# Altium schematic sheet TOP.SchDoc
size Tabloid
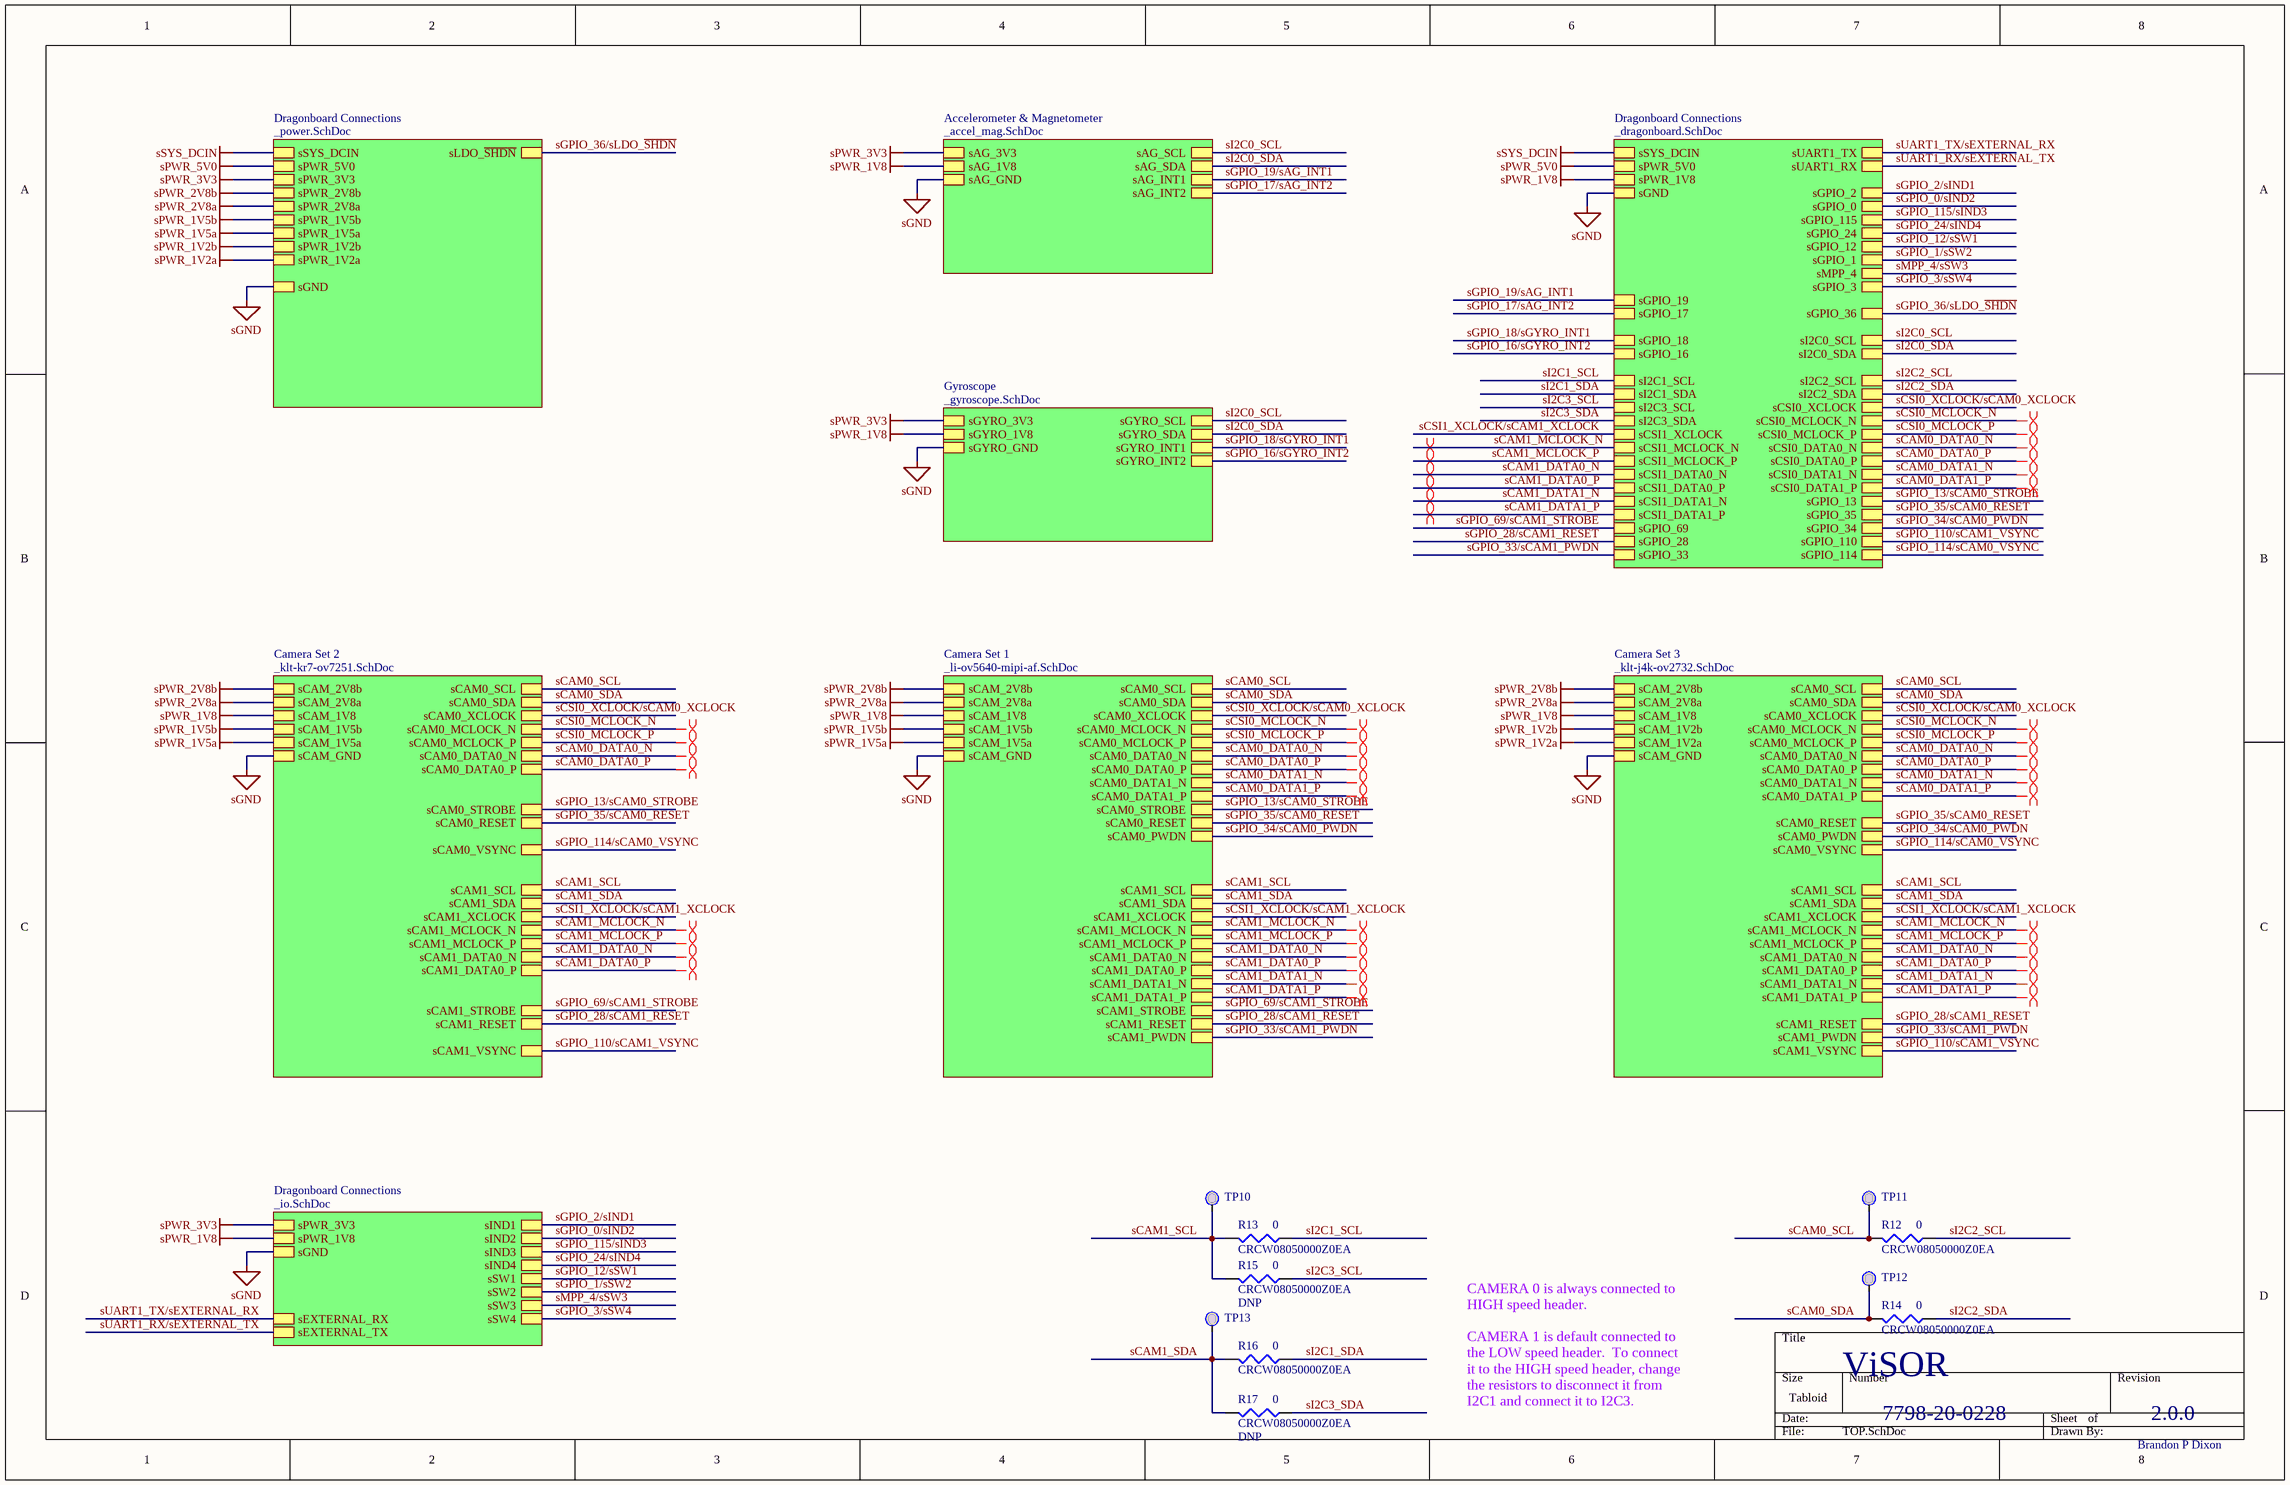
[diagram p0: TOP.SchDoc]

## Parts
R12  CRCW08050000Z0EA  value 0  [6-0805_M]
R13  CRCW08050000Z0EA  value 0  [6-0805_M]
R14  CRCW08050000Z0EA  value 0  [6-0805_M]
R15  CRCW08050000Z0EA  value 0  [6-0805_M]
R16  CRCW08050000Z0EA  value 0  [6-0805_M]
R17  CRCW08050000Z0EA  value 0  [6-0805_M]
TP10  TP  [TP_TH]  (value not drawn)
TP11  TP  [TP_TH]  (value not drawn)
TP12  TP  [TP_TH]  (value not drawn)
TP13  TP  [TP_TH]  (value not drawn)

## Sub-sheets
Accelerometer & Magnetometer = _accel_mag.SchDoc: sAG_GND, sAG_3V3, sAG_1V8, sAG_SCL, sAG_SDA, sAG_INT1, sAG_INT2
Camera Set 1 = _li-ov5640-mipi-af.SchDoc: sCAM_GND, sCAM_1V8, sCAM_1V5a, sCAM_1V5b, sCAM_2V8a, sCAM_2V8b, sCAM0_SCL, sCAM0_SDA, sCAM0_DATA0_N, sCAM0_DATA0_P, sCAM0_DATA1_N, sCAM0_DATA1_P, sCAM0_MCLOCK_N, sCAM0_MCLOCK_P, sCAM0_XCLOCK, sCAM0_STROBE, sCAM0_RESET, sCAM0_PWDN, sCAM1_SCL, sCAM1_SDA, sCAM1_DATA0_N, sCAM1_DATA0_P, sCAM1_DATA1_N, sCAM1_DATA1_P, sCAM1_MCLOCK_N, sCAM1_MCLOCK_P, sCAM1_XCLOCK, sCAM1_STROBE, sCAM1_RESET, sCAM1_PWDN
Camera Set 2 = _klt-kr7-ov7251.SchDoc: sCAM_GND, sCAM_1V8, sCAM_1V5a, sCAM_1V5b, sCAM_2V8a, sCAM_2V8b, sCAM0_SCL, sCAM0_SDA, sCAM0_DATA0_N, sCAM0_DATA0_P, sCAM0_MCLOCK_N, sCAM0_MCLOCK_P, sCAM0_XCLOCK, sCAM1_MCLOCK_N, sCAM1_MCLOCK_P, sCAM0_STROBE, sCAM0_RESET, sCAM0_VSYNC, sCAM1_STROBE, sCAM1_RESET, sCAM1_VSYNC, sCAM1_DATA0_N, sCAM1_DATA0_P, sCAM1_SCL, sCAM1_SDA, sCAM1_XCLOCK
Camera Set 3 = _klt-j4k-ov2732.SchDoc: sCAM_GND, sCAM_1V8, sCAM_1V2a, sCAM_1V2b, sCAM_2V8a, sCAM_2V8b, sCAM0_SCL, sCAM0_SDA, sCAM0_DATA0_N, sCAM0_DATA0_P, sCAM0_MCLOCK_N, sCAM0_MCLOCK_P, sCAM0_XCLOCK, sCAM0_RESET, sCAM0_VSYNC, sCAM1_VSYNC, sCAM0_DATA1_N, sCAM0_DATA1_P, sCAM1_SCL, sCAM1_SDA, sCAM1_DATA0_N, sCAM1_DATA0_P, sCAM1_MCLOCK_N, sCAM1_MCLOCK_P, sCAM1_XCLOCK, sCAM1_RESET, sCAM1_DATA1_N, sCAM1_DATA1_P, sCAM0_PWDN, sCAM1_PWDN
Dragonboard Connections = _dragonboard.SchDoc: sSYS_DCIN, sPWR_5V0, sPWR_1V8, sGND, sUART1_TX, sUART1_RX, sGPIO_115, sGPIO_24, sGPIO_12, sMPP_4, sI2C0_SCL, sI2C0_SDA, sGPIO_19, sGPIO_17, sGPIO_18, sGPIO_16, sGPIO_3, sGPIO_1, sGPIO_0, sGPIO_2, sGPIO_36, sI2C1_SCL, sI2C1_SDA, sI2C3_SCL, sI2C3_SDA, sCSI1_DATA0_N, sCSI1_DATA0_P, sCSI1_DATA1_N, sCSI1_DATA1_P, sCSI1_XCLOCK, sCSI1_MCLOCK_N, sCSI1_MCLOCK_P, sGPIO_69, sGPIO_28, sGPIO_33, sI2C2_SCL, sI2C2_SDA, sCSI0_DATA0_N, sCSI0_DATA0_P, sCSI0_DATA1_N, sCSI0_DATA1_P, sCSI0_MCLOCK_N, sCSI0_MCLOCK_P, sCSI0_XCLOCK, sGPIO_13, sGPIO_34, sGPIO_35, sGPIO_114, sGPIO_110
Dragonboard Connections = _power.SchDoc: sSYS_DCIN, sPWR_5V0, sGND, sLDO_~{SHDN}, sPWR_3V3, sPWR_1V5a, sPWR_1V5b, sPWR_2V8a, sPWR_2V8b, sPWR_1V2a, sPWR_1V2b
Dragonboard Connections = _io.SchDoc: sGND, sPWR_3V3, sIND1, sIND2, sIND3, sPWR_1V8, sIND4, sSW1, sSW2, sSW3, sSW4, sEXTERNAL_RX, sEXTERNAL_TX
Gyroscope = _gyroscope.SchDoc: sGYRO_GND, sGYRO_3V3, sGYRO_1V8, sGYRO_SCL, sGYRO_SDA, sGYRO_INT1, sGYRO_INT2

## Nets
sGND: sheet Dragonboard Connections/sGND, sheet Dragonboard Connections/sGND, sheet Dragonboard Connections/sGND, sheet Accelerometer & Magnetometer/sAG_GND, sheet Gyroscope/sGYRO_GND, sheet Camera Set 1/sCAM_GND, sheet Camera Set 2/sCAM_GND, sheet Camera Set 3/sCAM_GND
sPWR_1V2a: sheet Dragonboard Connections/sPWR_1V2a, sheet Camera Set 3/sCAM_1V2a
sPWR_1V2b: sheet Dragonboard Connections/sPWR_1V2b, sheet Camera Set 3/sCAM_1V2b
sPWR_1V5a: sheet Dragonboard Connections/sPWR_1V5a, sheet Camera Set 1/sCAM_1V5a, sheet Camera Set 2/sCAM_1V5a
sPWR_1V5b: sheet Dragonboard Connections/sPWR_1V5b, sheet Camera Set 1/sCAM_1V5b, sheet Camera Set 2/sCAM_1V5b
sPWR_1V8: sheet Dragonboard Connections/sPWR_1V8, sheet Dragonboard Connections/sPWR_1V8, sheet Accelerometer & Magnetometer/sAG_1V8, sheet Gyroscope/sGYRO_1V8, sheet Camera Set 1/sCAM_1V8, sheet Camera Set 2/sCAM_1V8, sheet Camera Set 3/sCAM_1V8
sPWR_2V8a: sheet Dragonboard Connections/sPWR_2V8a, sheet Camera Set 1/sCAM_2V8a, sheet Camera Set 2/sCAM_2V8a, sheet Camera Set 3/sCAM_2V8a
sPWR_2V8b: sheet Dragonboard Connections/sPWR_2V8b, sheet Camera Set 1/sCAM_2V8b, sheet Camera Set 2/sCAM_2V8b, sheet Camera Set 3/sCAM_2V8b
sPWR_3V3: sheet Dragonboard Connections/sPWR_3V3, sheet Dragonboard Connections/sPWR_3V3, sheet Accelerometer & Magnetometer/sAG_3V3, sheet Gyroscope/sGYRO_3V3
sPWR_5V0: sheet Dragonboard Connections/sPWR_5V0, sheet Dragonboard Connections/sPWR_5V0
sSYS_DCIN: sheet Dragonboard Connections/sSYS_DCIN, sheet Dragonboard Connections/sSYS_DCIN
sCAM0_DATA0_N: sheet Dragonboard Connections/sCSI0_DATA0_N, sheet Camera Set 1/sCAM0_DATA0_N, sheet Camera Set 2/sCAM0_DATA0_N, sheet Camera Set 3/sCAM0_DATA0_N
sCAM0_DATA0_P: sheet Dragonboard Connections/sCSI0_DATA0_P, sheet Camera Set 1/sCAM0_DATA0_P, sheet Camera Set 2/sCAM0_DATA0_P, sheet Camera Set 3/sCAM0_DATA0_P
sCAM0_DATA1_N: sheet Dragonboard Connections/sCSI0_DATA1_N, sheet Camera Set 1/sCAM0_DATA1_N, sheet Camera Set 3/sCAM0_DATA1_N
sCAM0_DATA1_P: sheet Dragonboard Connections/sCSI0_DATA1_P, sheet Camera Set 1/sCAM0_DATA1_P, sheet Camera Set 3/sCAM0_DATA1_P
sCAM0_SCL: R12.2 TP11.1 ; sheet Camera Set 1/sCAM0_SCL, sheet Camera Set 2/sCAM0_SCL, sheet Camera Set 3/sCAM0_SCL
sCAM0_SDA: R14.2 TP12.1 ; sheet Camera Set 1/sCAM0_SDA, sheet Camera Set 2/sCAM0_SDA, sheet Camera Set 3/sCAM0_SDA
sCAM1_DATA0_N: sheet Dragonboard Connections/sCSI1_DATA0_N, sheet Camera Set 1/sCAM1_DATA0_N, sheet Camera Set 2/sCAM1_DATA0_N, sheet Camera Set 3/sCAM1_DATA0_N
sCAM1_DATA0_P: sheet Dragonboard Connections/sCSI1_DATA0_P, sheet Camera Set 1/sCAM1_DATA0_P, sheet Camera Set 2/sCAM1_DATA0_P, sheet Camera Set 3/sCAM1_DATA0_P
sCAM1_DATA1_N: sheet Dragonboard Connections/sCSI1_DATA1_N, sheet Camera Set 1/sCAM1_DATA1_N, sheet Camera Set 3/sCAM1_DATA1_N
sCAM1_DATA1_P: sheet Dragonboard Connections/sCSI1_DATA1_P, sheet Camera Set 1/sCAM1_DATA1_P, sheet Camera Set 3/sCAM1_DATA1_P
sCAM1_MCLOCK_N: sheet Dragonboard Connections/sCSI1_MCLOCK_N, sheet Camera Set 1/sCAM1_MCLOCK_N, sheet Camera Set 2/sCAM1_MCLOCK_N, sheet Camera Set 3/sCAM1_MCLOCK_N
sCAM1_MCLOCK_P: sheet Dragonboard Connections/sCSI1_MCLOCK_P, sheet Camera Set 1/sCAM1_MCLOCK_P, sheet Camera Set 2/sCAM1_MCLOCK_P, sheet Camera Set 3/sCAM1_MCLOCK_P
sCAM1_SCL: R13.2 R15.2 TP10.1 ; sheet Camera Set 1/sCAM1_SCL, sheet Camera Set 2/sCAM1_SCL, sheet Camera Set 3/sCAM1_SCL
sCAM1_SDA: R16.2 R17.2 TP13.1 ; sheet Camera Set 1/sCAM1_SDA, sheet Camera Set 2/sCAM1_SDA, sheet Camera Set 3/sCAM1_SDA
sCSI0_MCLOCK_N: sheet Dragonboard Connections/sCSI0_MCLOCK_N, sheet Camera Set 1/sCAM0_MCLOCK_N, sheet Camera Set 2/sCAM0_MCLOCK_N, sheet Camera Set 3/sCAM0_MCLOCK_N
sCSI0_MCLOCK_P: sheet Dragonboard Connections/sCSI0_MCLOCK_P, sheet Camera Set 1/sCAM0_MCLOCK_P, sheet Camera Set 2/sCAM0_MCLOCK_P, sheet Camera Set 3/sCAM0_MCLOCK_P
sCSI0_XCLOCK/sCAM0_XCLOCK: sheet Dragonboard Connections/sCSI0_XCLOCK, sheet Camera Set 1/sCAM0_XCLOCK, sheet Camera Set 2/sCAM0_XCLOCK, sheet Camera Set 3/sCAM0_XCLOCK
sCSI1_XCLOCK/sCAM1_XCLOCK: sheet Dragonboard Connections/sCSI1_XCLOCK, sheet Camera Set 1/sCAM1_XCLOCK, sheet Camera Set 2/sCAM1_XCLOCK, sheet Camera Set 3/sCAM1_XCLOCK
sGPIO_0/sIND2: sheet Dragonboard Connections/sGPIO_0, sheet Dragonboard Connections/sIND2
sGPIO_1/sSW2: sheet Dragonboard Connections/sGPIO_1, sheet Dragonboard Connections/sSW2
sGPIO_2/sIND1: sheet Dragonboard Connections/sGPIO_2, sheet Dragonboard Connections/sIND1
sGPIO_3/sSW4: sheet Dragonboard Connections/sGPIO_3, sheet Dragonboard Connections/sSW4
sGPIO_12/sSW1: sheet Dragonboard Connections/sGPIO_12, sheet Dragonboard Connections/sSW1
sGPIO_13/sCAM0_STROBE: sheet Dragonboard Connections/sGPIO_13, sheet Camera Set 1/sCAM0_STROBE, sheet Camera Set 2/sCAM0_STROBE
sGPIO_16/sGYRO_INT2: sheet Dragonboard Connections/sGPIO_16, sheet Gyroscope/sGYRO_INT2
sGPIO_17/sAG_INT2: sheet Dragonboard Connections/sGPIO_17, sheet Accelerometer & Magnetometer/sAG_INT2
sGPIO_18/sGYRO_INT1: sheet Dragonboard Connections/sGPIO_18, sheet Gyroscope/sGYRO_INT1
sGPIO_19/sAG_INT1: sheet Dragonboard Connections/sGPIO_19, sheet Accelerometer & Magnetometer/sAG_INT1
sGPIO_24/sIND4: sheet Dragonboard Connections/sGPIO_24, sheet Dragonboard Connections/sIND4
sGPIO_28/sCAM1_RESET: sheet Dragonboard Connections/sGPIO_28, sheet Camera Set 1/sCAM1_RESET, sheet Camera Set 2/sCAM1_RESET, sheet Camera Set 3/sCAM1_RESET
sGPIO_33/sCAM1_PWDN: sheet Dragonboard Connections/sGPIO_33, sheet Camera Set 1/sCAM1_PWDN, sheet Camera Set 3/sCAM1_PWDN
sGPIO_34/sCAM0_PWDN: sheet Dragonboard Connections/sGPIO_34, sheet Camera Set 1/sCAM0_PWDN, sheet Camera Set 3/sCAM0_PWDN
sGPIO_35/sCAM0_RESET: sheet Dragonboard Connections/sGPIO_35, sheet Camera Set 1/sCAM0_RESET, sheet Camera Set 2/sCAM0_RESET, sheet Camera Set 3/sCAM0_RESET
sGPIO_36/sLDO_~{SHDN}: sheet Dragonboard Connections/sGPIO_36, sheet Dragonboard Connections/sLDO_~{SHDN}
sGPIO_69/sCAM1_STROBE: sheet Dragonboard Connections/sGPIO_69, sheet Camera Set 1/sCAM1_STROBE, sheet Camera Set 2/sCAM1_STROBE
sGPIO_110/sCAM1_VSYNC: sheet Dragonboard Connections/sGPIO_110, sheet Camera Set 2/sCAM1_VSYNC, sheet Camera Set 3/sCAM1_VSYNC
sGPIO_114/sCAM0_VSYNC: sheet Dragonboard Connections/sGPIO_114, sheet Camera Set 2/sCAM0_VSYNC, sheet Camera Set 3/sCAM0_VSYNC
sGPIO_115/sIND3: sheet Dragonboard Connections/sGPIO_115, sheet Dragonboard Connections/sIND3
sI2C0_SCL: sheet Dragonboard Connections/sI2C0_SCL, sheet Accelerometer & Magnetometer/sAG_SCL, sheet Gyroscope/sGYRO_SCL
sI2C0_SDA: sheet Dragonboard Connections/sI2C0_SDA, sheet Accelerometer & Magnetometer/sAG_SDA, sheet Gyroscope/sGYRO_SDA
sI2C1_SCL: R13.1 ; sheet Dragonboard Connections/sI2C1_SCL
sI2C1_SDA: R16.1 ; sheet Dragonboard Connections/sI2C1_SDA
sI2C2_SCL: R12.1 ; sheet Dragonboard Connections/sI2C2_SCL
sI2C2_SDA: R14.1 ; sheet Dragonboard Connections/sI2C2_SDA
sI2C3_SCL: R15.1 ; sheet Dragonboard Connections/sI2C3_SCL
sI2C3_SDA: R17.1 ; sheet Dragonboard Connections/sI2C3_SDA
sMPP_4/sSW3: sheet Dragonboard Connections/sMPP_4, sheet Dragonboard Connections/sSW3
sUART1_RX/sEXTERNAL_TX: sheet Dragonboard Connections/sUART1_RX, sheet Dragonboard Connections/sEXTERNAL_TX
sUART1_TX/sEXTERNAL_RX: sheet Dragonboard Connections/sUART1_TX, sheet Dragonboard Connections/sEXTERNAL_RX

## Layout directives
differential pair: sCAM0_DATA0_N, sCAM0_DATA0_P, sCAM0_DATA1_N, sCAM0_DATA1_P, sCAM1_DATA0_N, sCAM1_DATA0_P, sCAM1_DATA1_N, sCAM1_DATA1_P, sCAM1_MCLOCK_N, sCAM1_MCLOCK_P, sCSI0_MCLOCK_N, sCSI0_MCLOCK_P

## Notes on the sheet
- CAMERA 0 is always connected to HIGH speed header.
  CAMERA 1 is default connected to the LOW speed header.  To connect it to the HIGH speed header, change the resistors to disconnect it from I2C1 and connect it to I2C3.
- (near R14) ViSOR
- 7798-20-0228
- 2.0.0
- Brandon P Dixon
- (in symbol Res3) DNP

## Library data of the parts
R12-R17 = Res3: 0Ω Resistor; Published: 8-Jun-2000; LatestRevisionDate: 29-May-2009; LatestRevisionNote: IPC-7351 Footprint Added.; PackageReference: J1-0603; Publisher: Altium Limited; PackageDescription: Chip Resistor